# Altium project Batterry Monitor.PrjPcb
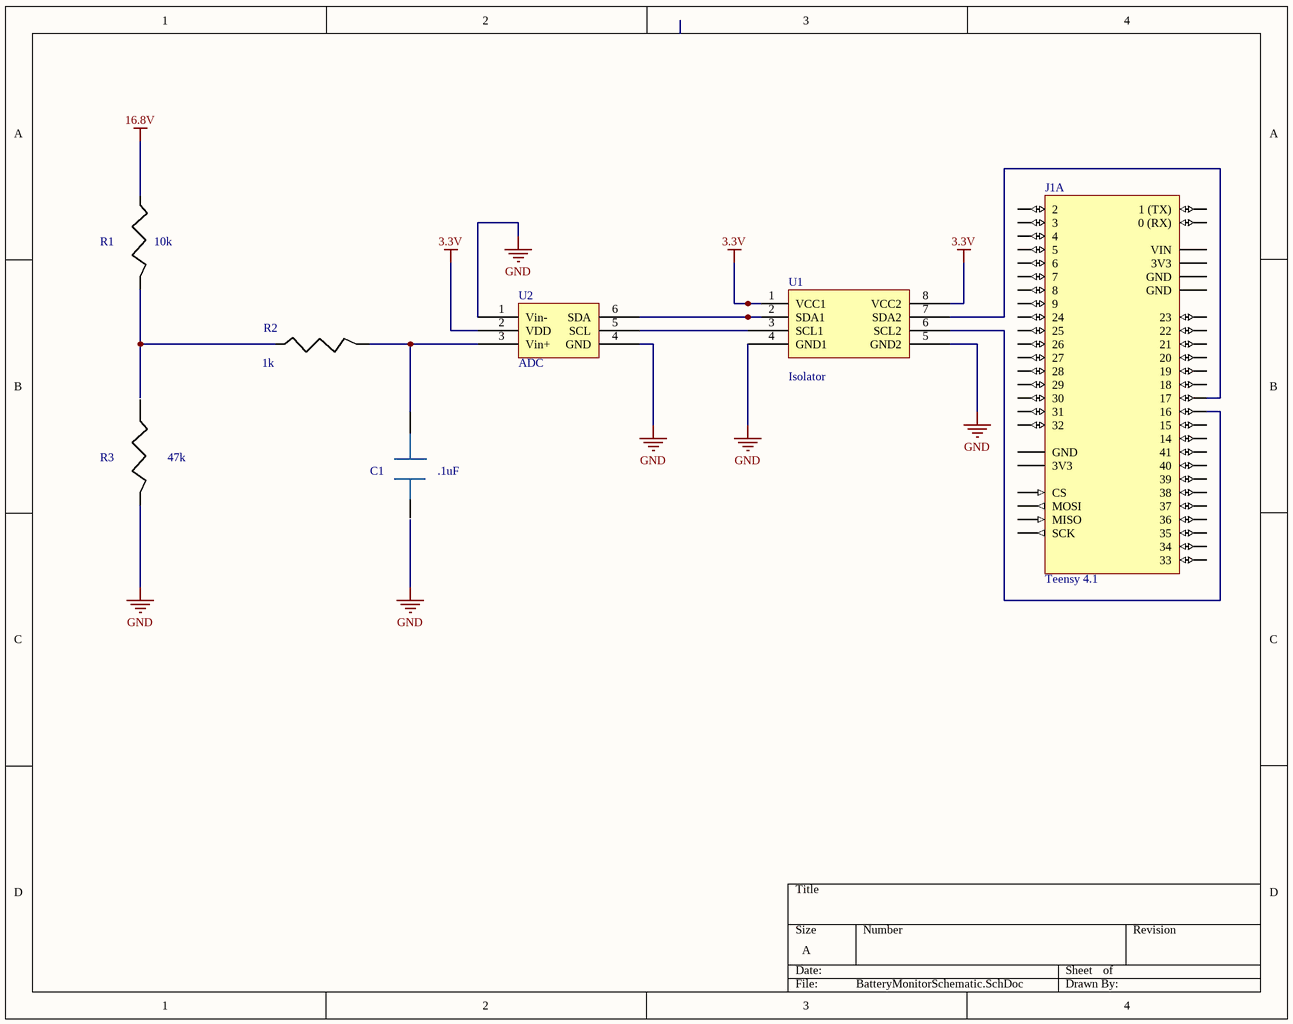
[diagram p0: BatteryMonitorSchematic.SchDoc]
1 sheet, 7 parts. Net scope: global (net labels, ports and power ports of the same name join across sheets).
Board file: BatteryMonitorPCB.PcbDoc

## Sheet BatteryMonitorSchematic.SchDoc
size A

### Parts
C1  UCB1V0R1MCL1GS  (value not drawn)
J1  Teensy 4.1  [Teensy4.1]  (part A of 2)
R1  Supplier Part Number 1: 10k
R2  1k Ohm RN73R2ETTD1001F25  (value not drawn)
R3  47k
U1  ISO1540DR  (value not drawn)
U2  ADC

### Nets
3.3V: U1.1(VCC1) U1.8(VCC2) U2.2(VDD)
GND: U1.4(GND1) U1.5(GND2) U2.1(Vin-) U2.4(GND)
NetJ1_38: J1.38(16) U1.6(SCL2)
NetJ1_39: J1.39(17) U1.7(SDA2)
NetU1_2: U1.2(SDA1) U2.6(SDA)
NetU1_3: U1.3(SCL1) U2.5(SCL)

Not connected (* = marked no-connect by the designer): J1 1(GND) 2(0_(RX)) 3(1_(TX)) 4(2) 5(3) 6(4) 7(5) 8(6) 9(7) 10(8) 11(9) 12(CS) 13(MOSI) 14(MISO) 15(3V3) 16(24) 17(25) 18(26) 19(27) 20(28) 21(29) 22(30) 23(31) 24(32) 25(33) 26(34) 27(35) 28(36) 29(37) 30(38) 31(39) 32(40) 33(41) 34(GND) 35(SCK) 36(14) 37(15) 40(18) 41(19) 42(20) 43(21) 44(22) 45(23) 46(3V3) 47(GND) 48(VIN); U2 3(Vin+)

### Notes on the sheet
- (near R2) 1k
- (near U1) Isolator
- (near C1) .1uF

### Library data of the parts
C1 = UCB1V0R1MCL1GS: Aluminum Electrolytic Capacitors - SMD 32volts 0.1uF 105c 4x7; Manufacturer: Nichicon; Capacitance: 100nF; Voltage Rating: 35V; Tolerance: 20%; Ripple Current: 1mA; Leakage Current: 4uA; Life (Hours): 7000Hour; Supplier 1: Digi-Key; Manufacturer Part Number: UCB1V0R1MCL1GS; RoHS: Yes; Category: Aluminum Electrolytic Capacitors; Stock 1: 255; Pricing 1: 1=0.40000, 10=0.27700, 50=0.19360, 100=0.16600, 500=0.12450 (USD); Mount: Surface Mount; Case/Package: Radial; Min Operating Temperature: -25°C; Max Operating Temperature: 105°C; Package Quantity: 1; Packaging: Tape and Reel; Voltage Rating (DC): 35V; Termination: SMD/SMT; Voltage: 35V; Features: General Purpose; Series: CB; Construction: Cylindrical; Diameter: 4mm; Length: 7mm; Height: 7mm; Height - Seated (Max): 0.287inch; RoHS Compliant: Yes; ComponentLink1URL: https://datasheet.ciiva.com/18524/e-cb-18524504.pdf?src-supplier=Digi-Key; ComponentLink1Description: https://datasheet.ciiva.com/18524/e-cb-18524504.pdf?src-supplier=Digi-Key; ComponentLink2URL: https://datasheet.ciiva.com/18524/e-cb-18524505.pdf?src-supplier=Digi-Key; ComponentLink2Description: https://datasheet.ciiva.com/18524/e-cb-18524505.pdf?src-supplier=Digi-Key; Supplier Part Number 1: 493-9956-1-ND
J1 = Teensy4.1
R1 R2 = RN73R2ETTD1001F25: Manufacturer: KOA Speer; Supplier 1: Digi-Key; Manufacturer Part Number: RN73R2ETTD1001F25; RoHS: No; Stock 1: 10000; Pricing 1: 1=0.69000, 10=0.51000, 100=0.29700, 1000=0.16656, 2500=0.16080 (USD)
  R2: Supplier Part Number 1: 1k Ohm (2019-RN73R2ETTD1001F25CT-ND)
R3 = 350247KJT (2): Resistor Thick Film 47kOhm 5% 2-Pin Surface Mount 3502 T/R; Manufacturer: TE Connectivity; Supplier 1: Arrow Electronics; Manufacturer Part Number: 350247KJT; ComponentLink1URL: http://datasheet.octopart.com/350247KJT-TE-Connectivity-datasheet-130072828.pdf?src-supplier=Electro+Sonic; ComponentLink1Description: http://datasheet.octopart.com/350247KJT-TE-Connectivity-datasheet-130072828.pdf?src-supplier=Electro+Sonic; ComponentLink2URL: http://sigma.octopart.com/130072831/technical_drawing/TE-Connectivity-350247KJT.pdf?src-supplier=TE+Connectivity; ComponentLink2Description: http://sigma.octopart.com/130072831/technical_drawing/TE-Connectivity-350247KJT.pdf?src-supplier=TE+Connectivity; Supplier Part Number 1: 47kOhm (GQM2195C2E7R9BB12D)
U1 = ISO1540DR: TEXAS INSTRUMENTS - ISO1540DR - DIGITAL ISOLATOR, 2-CH, 1MBPS, SOIC-8; Number of Channels: 2; Min Supply Voltage: 3V; Max Supply Voltage: 5.5V; Nominal Supply Current: 3.6mA; Channel Type: Bidirectional; Propagation Delay: 70ns; Isolated Power: No; Pulse Width Distortion (PWD): 21ns; Working Voltage: 566V; Supplier 1: Digi-Key; Manufacturer: Texas Instruments; Manufacturer Part Number: ISO1540DR; RoHS: Yes; Category: Interface ICs; Stock 1: 3199; Pricing 1: 1=4.78000, 10=4.28900, 25=4.05440, 100=3.33370, 250=2.99132, 500=2.88320, 1000=2.39666 (USD); Mount: Surface Mount; Case/Package: SOIC; Number of Pins: 8; Min Operating Temperature: -40°C; Max Operating Temperature: 125°C; Data Rate: 1Mbps; Packaging: Tape and Reel; Package Quantity: 1; Series: -; Supply Current: 3.6mA; REACH SVHC: No SVHC; Lead Free: Lead Free; RoHS Compliant: Yes; ComponentLink1URL: https://datasheet.ciiva.com/6579/iso1540-6579725.pdf?src-supplier=Digi-Key; ComponentLink1Description: https://datasheet.ciiva.com/6579/iso1540-6579725.pdf?src-supplier=Digi-Key; ComponentLink2URL: https://datasheet.ciiva.com/6579/iso1540-6579723.pdf?src-supplier=Digi-Key; ComponentLink2Description: https://datasheet.ciiva.com/6579/iso1540-6579723.pdf?src-supplier=Digi-Key; ComponentLink3URL: https://datasheet.ciiva.com/6579/iso1540-6579724.pdf?src-supplier=Digi-Key; ComponentLink3Description: https://datasheet.ciiva.com/6579/iso1540-6579724.pdf?src-supplier=Digi-Key; ComponentLink4URL: https://datasheet.ciiva.com/14196/iso1540-14196749.pdf?src-supplier=Avnet; ComponentLink4Description: https://datasheet.ciiva.com/14196/iso1540-14196749.pdf?src-supplier=Avnet; Supplier Part Number 1: 296-34871-1-ND
U2 = ADS1000A0IDBVT: IC ADC 12BIT I2C INTRFC SOT23-6; Manufacturer: Texas Instruments; Sampling Rate: 128S/s; Resolution: 12b; Polarity: Bipolar; Number of Channels: 1; Max Supply Voltage: 5.5V; Min Supply Voltage: 2.7V; Max Power Dissipation: 750uW; Operating Supply Voltage: 5V; Number of Bits: 12; Integral Nonlinearity (INL): 1LSB; Nominal Supply Current: 90uA; Supply Type: Single; ADS1000A0IDBVT: 296-20737-1-ND; Supplier 1: Digi-Key; Manufacturer Part Number: ADS1000A0IDBVT; RoHS: Yes; Category: Analog to Digital Converters (ADCs); Stock 1: 586; Pricing 1: 1=2.88000, 10=2.58400, 25=2.43800, 100=1.95040 (USD); Mount: Surface Mount; Case/Package: SOT-23; Number of Pins: 6; Contact Plating: Gold; Min Operating Temperature: -40°C; Max Operating Temperature: 125°C; Package Quantity: 250; Interface: I2C; Packaging: Tape and Reel; Number of Inputs: 1; Number of A/D Converters: 1; Number of Converters: 1; Number of Elements: 1; Power Dissipation: 750uW; Number of Analog Inputs: 1; Conversion Rate: 128S/s; Differential Nonlinearity: 1LSB; Termination: SMD/SMT; Length: 2.9mm; Width: 1.6mm; Height: 1.15mm; Radiation Hardening: No; Lead Free: Lead Free; RoHS Compliant: Yes; REACH SVHC: No SVHC; ComponentLink1URL: https://datasheet.ciiva.com/34304/2045835-34304018.pdf?src-supplier=Jameco; ComponentLink1Description: https://datasheet.ciiva.com/34304/2045835-34304018.pdf?src-supplier=Jameco; ComponentLink2URL: https://datasheet.ciiva.com/3038/sbas357a-3038709.pdf?src-supplier=Avnet; ComponentLink2Description: https://datasheet.ciiva.com/3038/sbas357a-3038709.pdf?src-supplier=Avnet; ComponentLink3URL: https://datasheet.ciiva.com/1704/1831216-1704227.pdf?src-supplier=Element14; ComponentLink3Description: https://datasheet.ciiva.com/1704/1831216-1704227.pdf?src-supplier=Element14; ComponentLink4URL: https://datasheet.ciiva.com/3037/sbas357a-3037894.pdf?src-supplier=Avnet; ComponentLink4Description: https://datasheet.ciiva.com/3037/sbas357a-3037894.pdf?src-supplier=Avnet; ComponentLink5URL: https://datasheet.ciiva.com/7989/ads1000-7989305.pdf?src-supplier=Element14; ComponentLink5Description: https://datasheet.ciiva.com/7989/ads1000-7989305.pdf?src-supplier=Element14; ComponentLink6URL: https://datasheet.ciiva.com/15148/getdatasheetpartid-184680-15148061.pdf?src-supplier=Verical; ComponentLink6Description: https://datasheet.ciiva.com/15148/getdatasheetpartid-184680-15148061.pdf?src-supplier=Verical; ComponentLink7URL: https://datasheet.ciiva.com/1275/ads1000-1275150.pdf?src-supplier=Digi-Key; ComponentLink7Description: https://datasheet.ciiva.com/1275/ads1000-1275150.pdf?src-supplier=Digi-Key; ComponentLink8URL: https://datasheet.ciiva.com/1275/ads1000-1275151.pdf?src-supplier=Digi-Key; ComponentLink8Description: https://datasheet.ciiva.com/1275/ads1000-1275151.pdf?src-supplier=Digi-Key